# EAGLE schematic Final Project Circuit Diagram (EAGLE 7.2.0)
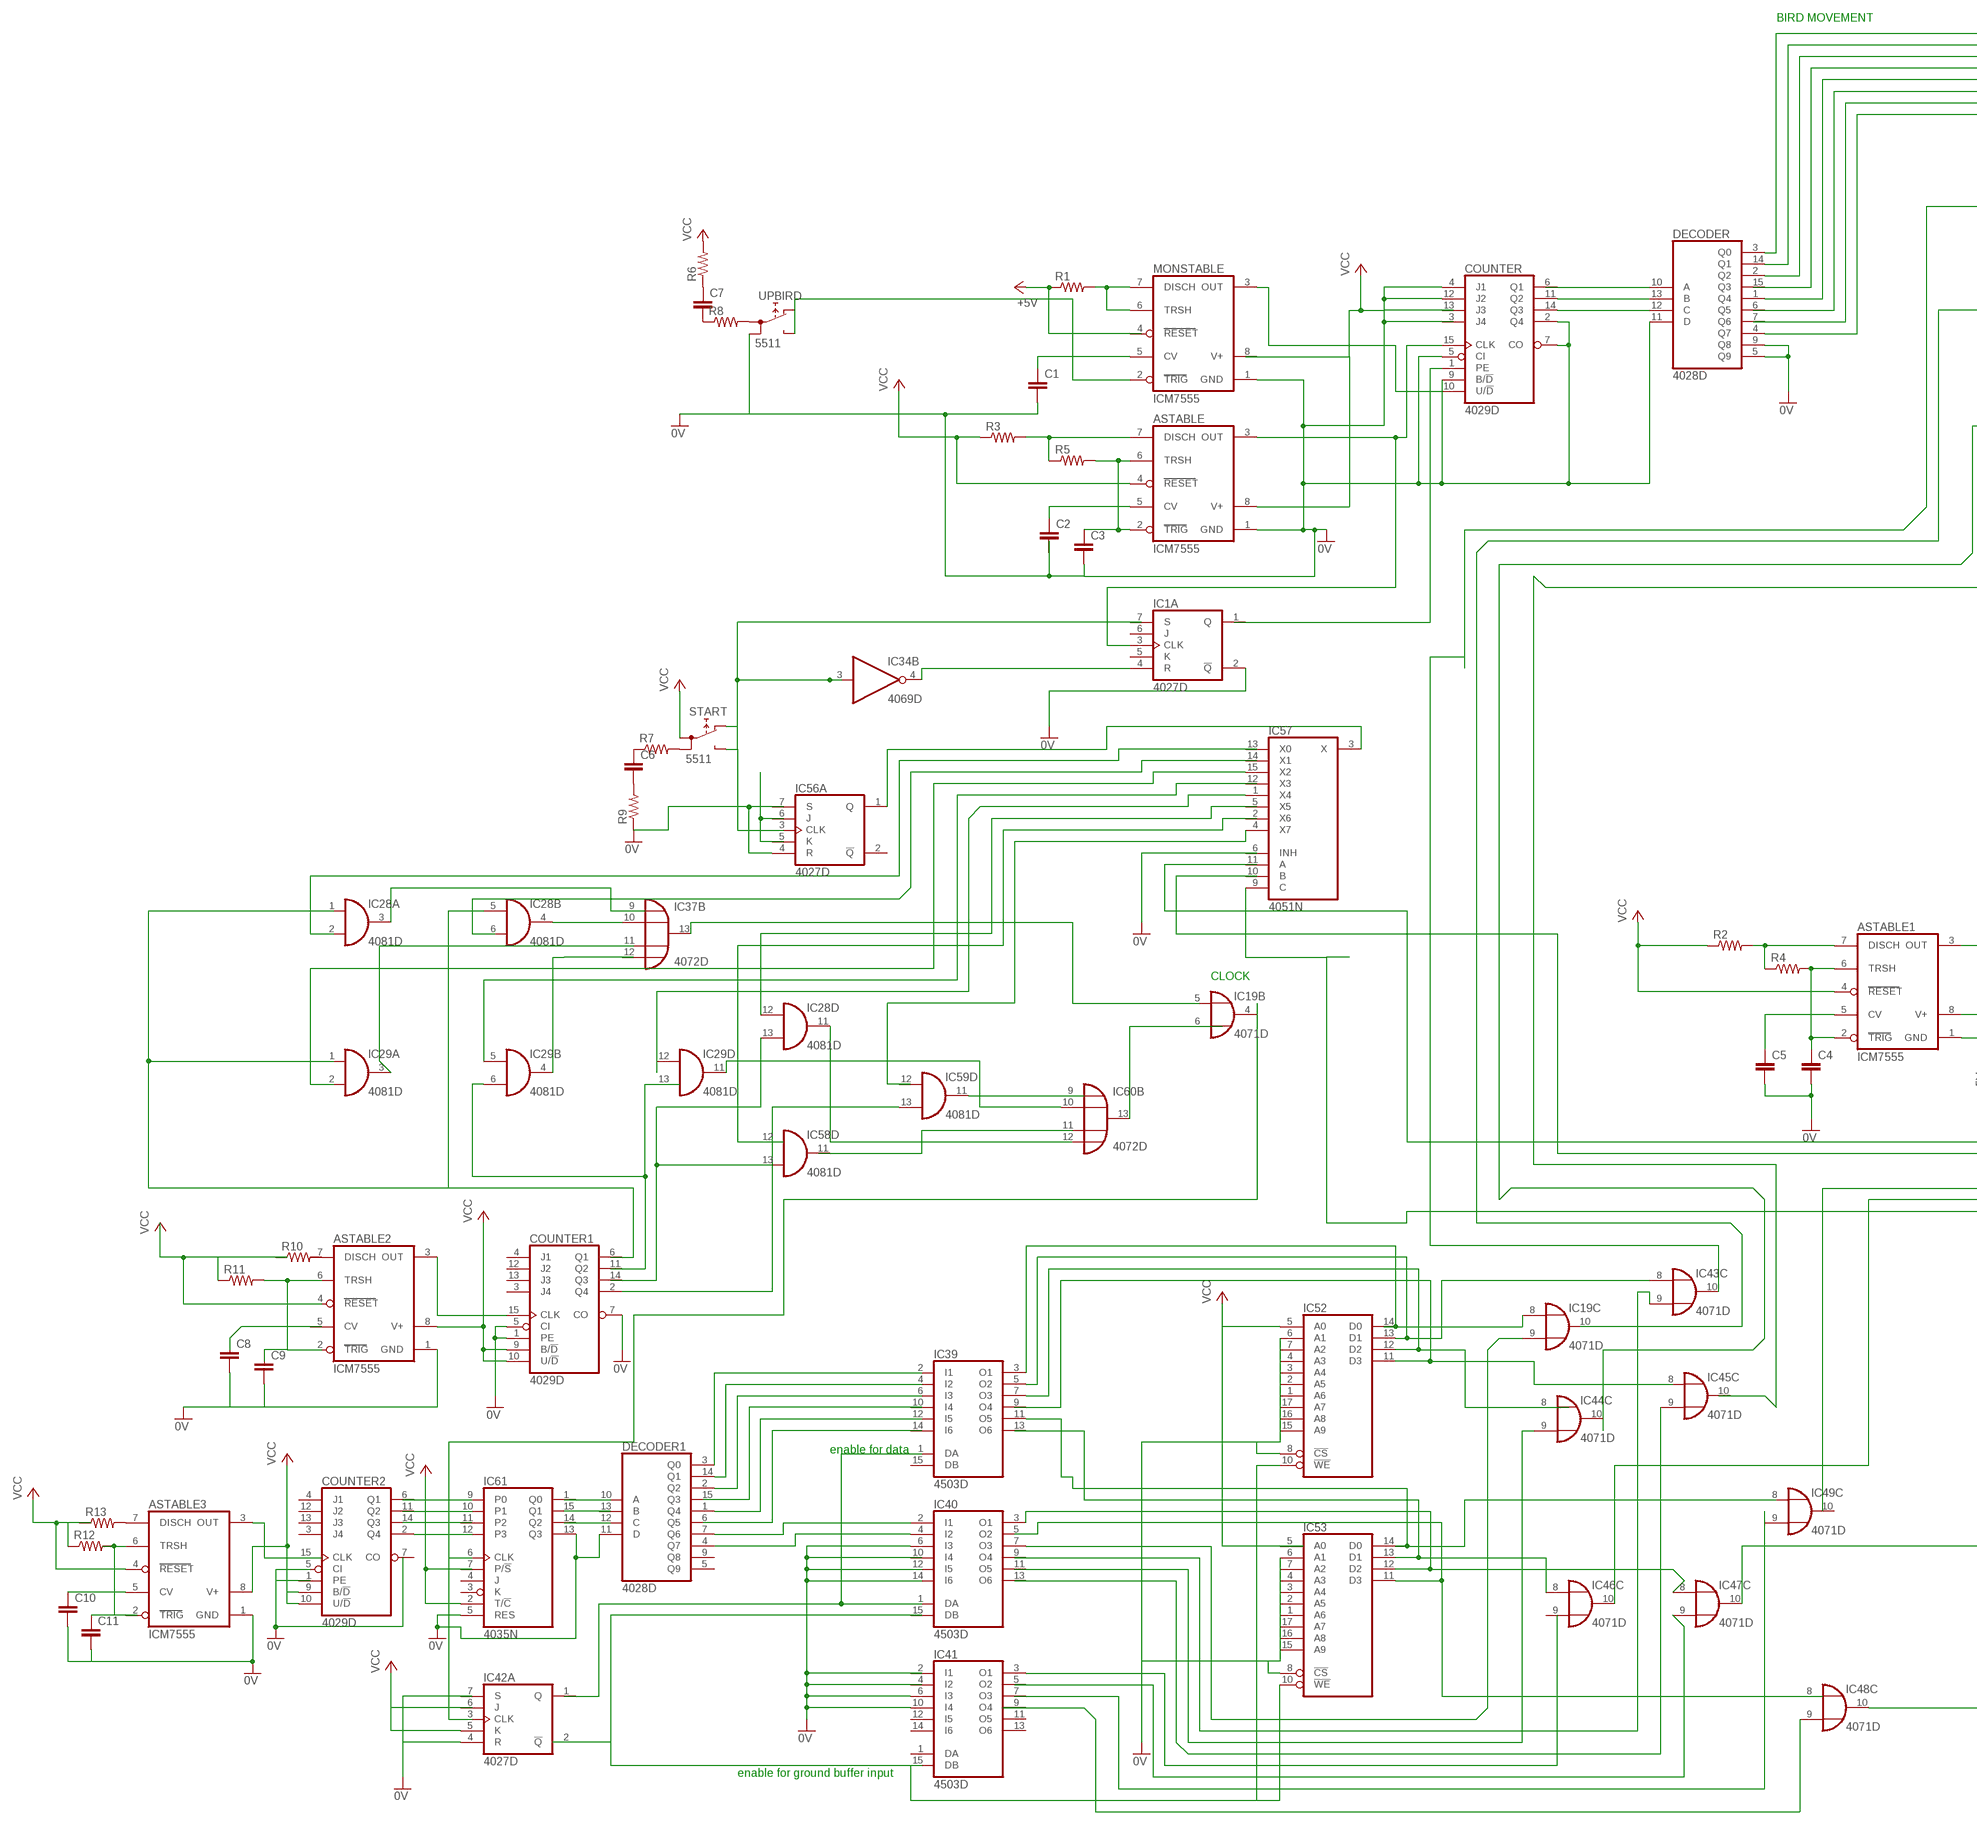
[diagram p0: schematic, sheet 1, part 1 of 2]
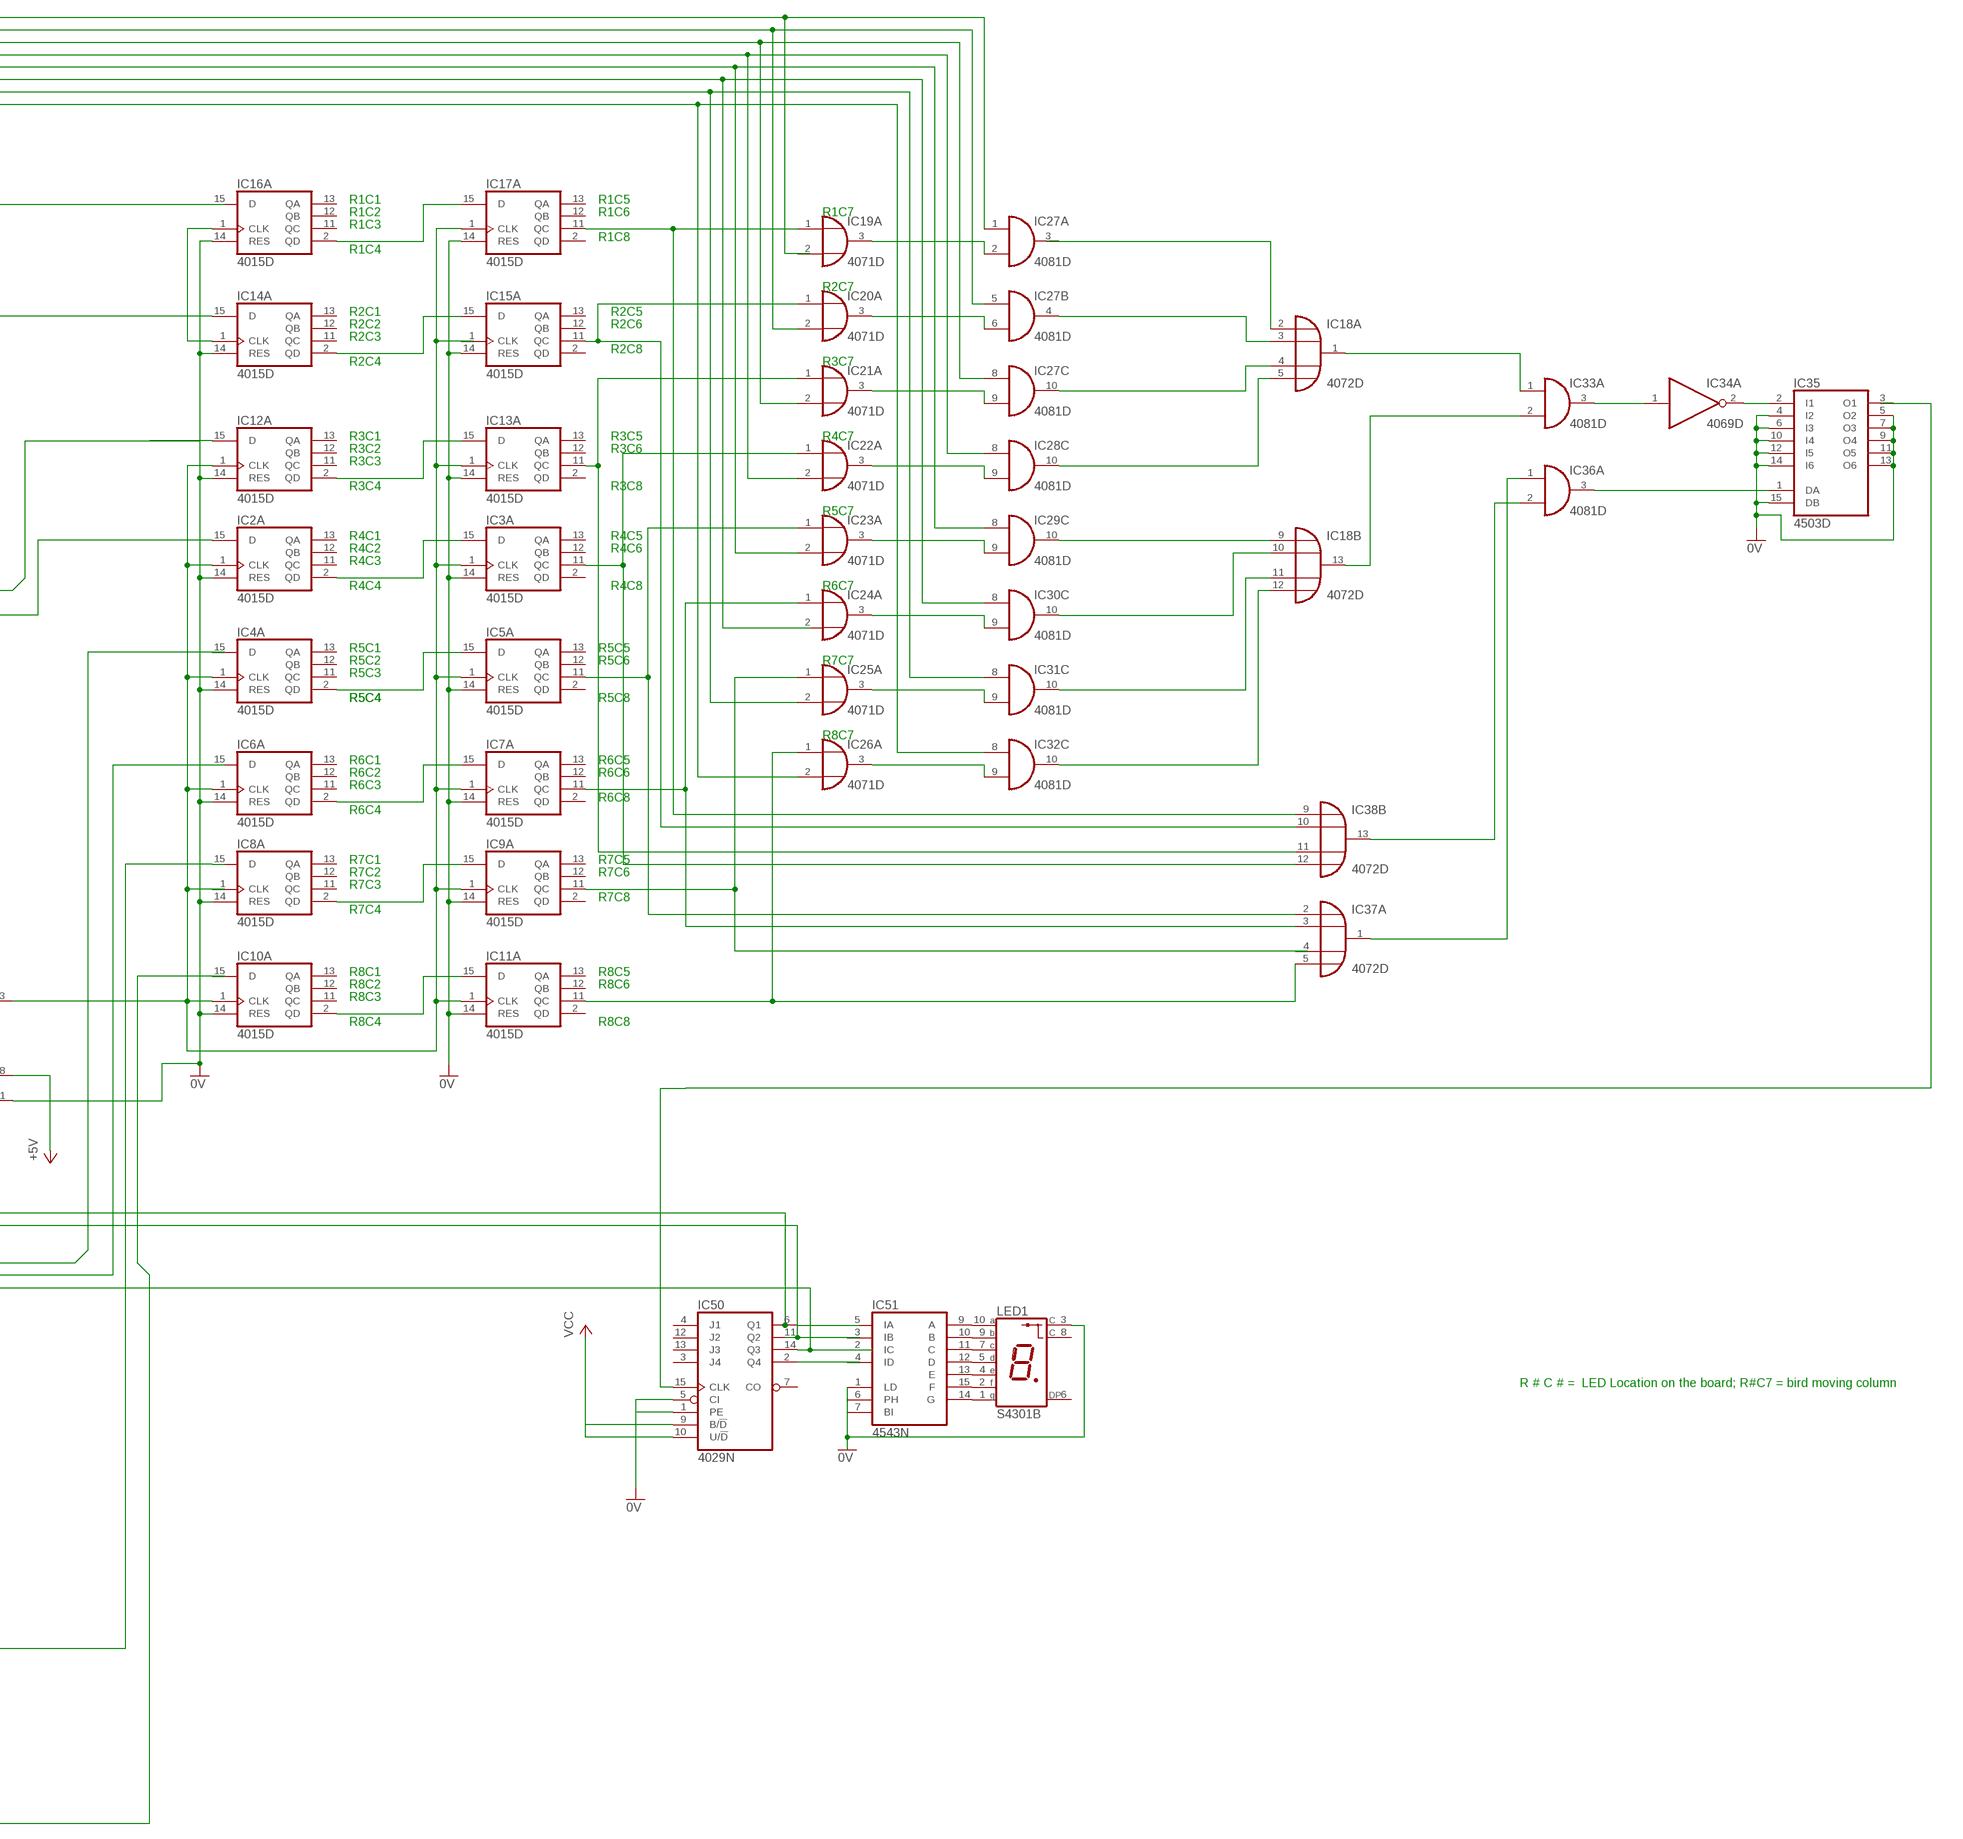
[diagram p1: schematic, sheet 1, part 2 of 2]

## Parts
ASTABLE  ICM7555  [DIL08]
ASTABLE1  ICM7555  [DIL08]
ASTABLE2  ICM7555  [DIL08]
ASTABLE3  ICM7555  [DIL08]
C1  C2.5/2  [C2.5-2]
C2  C2.5/2  [C2.5-2]
C3  C2.5/2  [C2.5-2]
C4  C2.5/2  [C2.5-2]
C5  C2.5/2  [C2.5-2]
C6  C2.5/2  [C2.5-2]
C7  C2.5/2  [C2.5-2]
C8  C2.5/2  [C2.5-2]
C9  C2.5/2  [C2.5-2]
C10  C2.5/2  [C2.5-2]
C11  C2.5/2  [C2.5-2]
COUNTER  4029D  [SO16]
COUNTER1  4029D  [SO16]
COUNTER2  4029D  [SO16]
DECODER  4028D  [SO16]
DECODER1  4028D  [SO16]
IC1  4027D  [SO16]
IC2  4015D  [SO16]
IC3  4015D  [SO16]
IC4  4015D  [SO16]
IC5  4015D  [SO16]
IC6  4015D  [SO16]
IC7  4015D  [SO16]
IC8  4015D  [SO16]
IC9  4015D  [SO16]
IC10  4015D  [SO16]
IC11  4015D  [SO16]
IC12  4015D  [SO16]
IC13  4015D  [SO16]
IC14  4015D  [SO16]
IC15  4015D  [SO16]
IC16  4015D  [SO16]
IC17  4015D  [SO16]
IC18  4072D  [SO14]
IC19  4071D  [SO14]
IC20  4071D  [SO14]
IC21  4071D  [SO14]
IC22  4071D  [SO14]
IC23  4071D  [SO14]
IC24  4071D  [SO14]
IC25  4071D  [SO14]
IC26  4071D  [SO14]
IC27  4081D  [SO14]
IC28  4081D  [SO14]
IC29  4081D  [SO14]
IC30  4081D  [SO14]
IC31  4081D  [SO14]
IC32  4081D  [SO14]
IC33  4081D  [SO14]
IC34  4069D  [SO14]
IC35  4503D  [SO16]
IC36  4081D  [SO14]
IC37  4072D  [SO14]
IC38  4072D  [SO14]
IC39  4503D  [SO16]
IC40  4503D  [SO16]
IC41  4503D  [SO16]
IC42  4027D  [SO16]
IC43  4071D  [SO14]
IC44  4071D  [SO14]
IC45  4071D  [SO14]
IC46  4071D  [SO14]
IC47  4071D  [SO14]
IC48  4071D  [SO14]
IC49  4071D  [SO14]
IC50  4029N  [DIL16]
IC51  4543N  [DIL16]
IC52  2114  [DIL18]
IC53  2114  [DIL18]
IC56  4027D  [SO16]
IC57  4051N  [DIL16]
IC58  4081D  [SO14]
IC59  4081D  [SO14]
IC60  4072D  [SO14]
IC61  4035N  [DIL16]
LED1  S4301B  [S4301B]
MONSTABLE  ICM7555  [DIL08]
R1  R-US_0204/7  [0204/7]
R2  R-US_0204/7  [0204/7]
R3  R-US_0204/7  [0204/7]
R4  R-US_0204/7  [0204/7]
R5  R-US_0204/7  [0204/7]
R6  R-US_0204/7  [0204/7]
R7  R-US_0204/7  [0204/7]
R8  R-US_0204/7  [0204/7]
R9  R-US_0204/7  [0204/7]
R10  R-US_0204/7  [0204/7]
R11  R-US_0204/7  [0204/7]
R12  R-US_0204/7  [0204/7]
R13  R-US_0204/7  [0204/7]
START  5511  [5511]
UPBIRD  5511  [5511]

## Nets
0V: ASTABLE1.1(GND) ASTABLE2.1(GND) ASTABLE3.1(GND) ASTABLE.1(GND) ASTABLE.8(V+) C1.2 C3.2 C4.2 C5.2 C8.2 C9.2 C10.2 COUNTER1.7(CO) COUNTER.2(Q4) COUNTER.4(J1) COUNTER.5(CI) COUNTER.7(CO) COUNTER.9(B/!D) COUNTER.12(J2) DECODER1.11(D) DECODER.5(Q9) DECODER.9(Q8) DECODER.11(D) IC1.2(A:!Q) IC2.14(A:RES) IC3.14(A:RES) IC4.14(A:RES) IC5.14(A:RES) IC6.14(A:RES) IC7.14(A:RES) IC8.14(A:RES) IC9.14(A:RES) IC10.14(A:RES) IC11.14(A:RES) IC12.14(A:RES) IC13.14(A:RES) IC14.14(A:RES) IC15.14(A:RES) IC16.14(A:RES) IC17.14(A:RES) IC35.4(I2) IC35.5(O2) IC35.6(I3) IC35.7(O3) IC35.9(O4) IC35.10(I4) IC35.11(O5) IC35.12(I5) IC35.13(O6) IC35.14(I6) IC35.15(DB) IC40.6(I3) IC41.6(I3) IC41.10(I4) IC50.1(PE) IC50.5(CI) IC51.1(LD) IC52.6(A1) IC52.8(!CS) IC56.4(A:R) IC61.5(RES) IC61.13(Q3) LED1.3(C) MONSTABLE.1(GND) R9.1 UPBIRD.1B ; supply symbol labelled VCC
+5V: ASTABLE1.8(V+) R1.1
N$1: MONSTABLE.2(TRIG) UPBIRD.NC UPBIRD.NO
N$2: COUNTER.10(U/!D) MONSTABLE.3(OUT)
N$3: DECODER.10(A)
N$4: COUNTER.11(Q2) DECODER.13(B)
N$5: COUNTER.14(Q3) DECODER.12(C)
N$6: ASTABLE.5(CV) C2.1
N$7: ASTABLE1.3(OUT) IC2.1(A:CLK) IC3.1(A:CLK) IC4.1(A:CLK) IC5.1(A:CLK) IC6.1(A:CLK) IC7.1(A:CLK) IC9.1(A:CLK) IC10.1(A:CLK) IC11.1(A:CLK) IC12.1(A:CLK) IC13.1(A:CLK) IC17.1(A:CLK)
N$8: IC16.2(A:QD) IC17.15(A:D)
N$9: COUNTER.1(PE)
N$10: C1.1 MONSTABLE.5(CV)
N$11: MONSTABLE.6(TRSH) MONSTABLE.7(DISCH) R1.2
N$12: IC14.2(A:QD) IC15.15(A:D)
N$13: ASTABLE.7(DISCH) R3.2 R5.1
N$14: ASTABLE.3(OUT) COUNTER.15(CLK)
N$15: ASTABLE.2(TRIG) ASTABLE.6(TRSH) C3.1 R5.2
N$16: IC12.2(A:QD) IC13.15(A:D)
N$17: IC2.2(A:QD) IC3.15(A:D)
N$18: IC4.2(A:QD) IC5.15(A:D)
N$19: IC6.2(A:QD) IC7.15(A:D)
N$20: IC8.2(A:QD) IC9.15(A:D)
N$21: IC10.2(A:QD) IC11.15(A:D)
N$22: IC3.11(A:QC) IC22.1(A:I0) IC38.12(B:I3)
N$23: IC17.11(A:QC) IC19.1(A:I0) IC38.9(B:I0)
N$24: ASTABLE1.7(DISCH) R2.2 R4.1
N$25: IC15.11(A:QC) IC20.1(A:I0) IC38.10(B:I1)
N$26: IC13.11(A:QC) IC21.1(A:I0) IC38.11(B:I2)
N$27: ASTABLE1.5(CV) C5.1
N$28: ASTABLE1.2(TRIG) ASTABLE1.6(TRSH) C4.1 R4.2
N$29: IC5.11(A:QC) IC23.1(A:I0) IC37.2(A:I0)
N$30: IC7.11(A:QC) IC24.1(A:I0) IC37.3(A:I1)
N$31: IC9.11(A:QC) IC25.1(A:I0)
N$32: IC11.11(A:QC) IC26.1(A:I0) IC37.5(A:I3)
N$33: DECODER.3(Q0) IC27.1(A:I0)
N$34: DECODER.14(Q1) IC20.2(A:I1) IC27.5(B:I0)
N$35: DECODER.2(Q2) IC21.2(A:I1) IC27.8(C:I0)
N$36: IC22.2(A:I1) IC28.8(C:I0)
N$37: DECODER.1(Q4) IC23.2(A:I1) IC29.8(C:I0)
N$38: IC30.8(C:I0)
N$39: IC25.2(A:I1) IC31.8(C:I0)
N$40: DECODER.4(Q7) IC26.2(A:I1) IC32.8(C:I0)
N$41: IC19.3(A:O) IC27.2(A:I1)
N$42: IC20.3(A:O) IC27.6(B:I1)
N$43: IC21.3(A:O) IC27.9(C:I1)
N$44: IC22.3(A:O) IC28.9(C:I1)
N$45: IC23.3(A:O) IC29.9(C:I1)
N$46: IC24.3(A:O) IC30.9(C:I1)
N$47: IC25.3(A:O) IC31.9(C:I1)
N$48: IC26.3(A:O) IC32.9(C:I1)
N$49: IC18.2(A:I0)
N$50: IC18.3(A:I1) IC27.4(B:O)
N$51: IC18.4(A:I2) IC27.10(C:O)
N$52: IC18.5(A:I3) IC28.10(C:O)
N$53: IC18.9(B:I0) IC29.10(C:O)
N$54: IC18.12(B:I3) IC32.10(C:O)
N$55: IC18.11(B:I2) IC31.10(C:O)
N$56: IC18.10(B:I1) IC30.10(C:O)
N$57: IC18.1(A:O) IC33.1(A:I0)
N$58: IC18.13(B:O) IC33.2(A:I1)
N$59: IC33.3(A:O) IC34.1(A:I)
N$60: IC34.2(A:O) IC35.2(I1)
N$61: IC35.1(DA) IC36.3(A:O)
N$62: IC36.1(A:I0) IC37.1(A:O)
N$63: IC36.2(A:I1) IC38.13(B:O)
N$64: IC39.11(O5) IC53.14(D0)
N$65: DECODER1.3(Q0)
N$66: DECODER1.14(Q1)
N$67: DECODER1.2(Q2)
N$69: DECODER1.1(Q4)
N$71: DECODER1.7(Q6) IC40.2(I1)
N$72: DECODER1.4(Q7) IC40.4(I2)
N$73: IC42.5(A:K) ; supply symbol labelled VCC
N$74: IC19.8(C:I0) IC39.3(O1) IC52.14(D0)
N$75: IC42.4(A:R) ; supply symbol labelled 0V
N$77: IC52.10(!WE) IC53.10(!WE)
N$78: IC39.5(O2) IC43.8(C:I0) IC52.13(D1)
N$79: IC39.7(O3) IC52.12(D2)
N$80: IC14.1(A:CLK) IC16.1(A:CLK)
N$81: IC14.15(A:D)
N$82: IC12.15(A:D)
N$83: IC2.15(A:D)
N$86: IC48.10(C:O)
N$87: IC50.6(Q1)
N$88: IC50.11(Q2)
N$89: IC8.15(A:D) IC47.10(C:O)
N$90: IC50.14(Q3) IC57.9(C)
N$91: IC50.2(Q4)
N$92: C7.2 R8.1
N$93: C7.1 R6.1
N$94: R8.2 UPBIRD.1A
N$96: R7.2 START.1B
N$97: C6.1 R7.1
N$98: C6.2 R9.2
N$99: IC34.3(B:I) START.NC START.NO
N$100: IC1.3(A:CLK)
N$101: IC1.4(A:R) IC34.4(B:O)
N$102: R11.1
N$103: C9.1 R11.2
N$104: COUNTER1.1(PE) COUNTER1.5(CI) ; supply symbol labelled 0V
N$105: C8.1
N$107: IC28.5(B:I0)
N$108: ASTABLE2.3(OUT) COUNTER1.15(CLK)
N$111: IC57.15(X2)
N$112: IC56.1(A:Q) IC57.3(X)
N$114: IC29.6(B:I1)
N$115: IC29.5(B:I0)
N$116: IC57.1(X4)
N$117: IC28.13(D:I1)
N$118: IC57.4(X7) IC59.12(D:I0)
N$119: IC28.12(D:I0)
N$121: IC59.11(D:O)
N$122: COUNTER1.2(Q4) IC59.13(D:I1)
N$123: IC28.11(D:O)
N$125: IC29.11(D:O) IC60.10(B:I1)
N$126: IC28.3(A:O)
N$127: IC28.4(B:O) IC37.10(B:I1)
N$128: IC29.3(A:O)
N$129: ASTABLE3.7(DISCH) R13.2
N$130: IC29.4(B:O)
N$131: IC37.13(B:O)
N$132: IC60.13(B:O)
N$133: ASTABLE3.3(OUT)
N$134: ASTABLE3.6(TRSH) R12.2
N$135: C11.1
N$136: ASTABLE3.5(CV) C10.1
N$138: C11.2
N$141: COUNTER2.2(Q4)
N$146: IC53.6(A1) IC53.8(!CS)
N$147: IC46.8(C:I0) IC53.13(D1)
N$148: IC40.3(O1) IC47.8(C:I0) IC53.12(D2)
N$149: IC53.11(D3)
N$150: IC43.10(C:O)
N$151: IC52.11(D3)
N$152: IC19.9(C:I1) IC40.7(O3)
N$153: IC43.9(C:I1)
N$154: IC44.9(C:I1)
N$155: IC45.9(C:I1)
N$156: IC41.3(O1)
N$157: IC47.9(C:I1)
N$159: IC48.9(C:I1)
N$165: IC46.10(C:O)
N$166: IC50.15(CLK)
N$167: IC51.15(F) LED1.2(F)
N$168: IC51.12(D) LED1.5(D)
N$169: IC51.10(B) LED1.9(B)
N$170: IC51.9(A) LED1.10(A)
N$171: IC51.11(C) LED1.7(C)
N$172: IC51.13(E) LED1.4(E)
N$173: IC51.14(G) LED1.1(G)
VCC: ASTABLE1.4(RESET) ASTABLE2.8(V+) ASTABLE3.4(RESET) ASTABLE3.8(V+) ASTABLE.4(RESET) COUNTER1.9(B/!D) COUNTER1.10(U/!D) COUNTER2.9(B/!D) COUNTER2.10(U/!D) IC50.9(B/!D) IC50.10(U/!D) IC52.5(A0) IC61.2(T/!C) R2.1 R3.1 R6.2 R12.1 START.1A
Unconnected: ASTABLE2.2(TRIG) ASTABLE2.4(RESET) ASTABLE2.5(CV) ASTABLE2.6(TRSH) ASTABLE2.7(DISCH) ASTABLE3.2(TRIG) C2.2 COUNTER1.3(J4) COUNTER1.4(J1) COUNTER1.6(Q1) COUNTER1.11(Q2) COUNTER1.12(J2) COUNTER1.13(J3) COUNTER1.14(Q3) COUNTER2.1(PE) COUNTER2.3(J4) COUNTER2.4(J1) COUNTER2.5(CI) COUNTER2.6(Q1) COUNTER2.7(CO) COUNTER2.11(Q2) COUNTER2.12(J2) COUNTER2.13(J3) COUNTER2.14(Q3) COUNTER2.15(CLK) COUNTER.3(J4) COUNTER.6(Q1) COUNTER.13(J3) DECODER1.5(Q9) DECODER1.6(Q5) DECODER1.9(Q8) DECODER1.10(A) DECODER1.12(C) DECODER1.13(B) DECODER1.15(Q3) DECODER.6(Q5) DECODER.7(Q6) DECODER.15(Q3) IC1.1(A:Q) IC1.5(A:K) IC1.6(A:J) IC1.7(A:S) IC1.9(B:S) IC1.10(B:J) IC1.11(B:K) IC1.12(B:R) IC1.13(B:CLK) IC1.14(B:!Q) IC1.15(B:Q) IC2.3(B:QC) IC2.4(B:QB) IC2.5(B:QA) IC2.6(B:RES) IC2.7(B:D) IC2.9(B:CLK) IC2.10(B:QD) IC2.11(A:QC) IC2.12(A:QB) IC2.13(A:QA) IC3.2(A:QD) IC3.3(B:QC) IC3.4(B:QB) IC3.5(B:QA) IC3.6(B:RES) IC3.7(B:D) IC3.9(B:CLK) IC3.10(B:QD) IC3.12(A:QB) IC3.13(A:QA) IC4.3(B:QC) IC4.4(B:QB) IC4.5(B:QA) IC4.6(B:RES) IC4.7(B:D) IC4.9(B:CLK) IC4.10(B:QD) IC4.11(A:QC) IC4.12(A:QB) IC4.13(A:QA) IC4.15(A:D) IC5.2(A:QD) IC5.3(B:QC) IC5.4(B:QB) IC5.5(B:QA) IC5.6(B:RES) IC5.7(B:D) IC5.9(B:CLK) IC5.10(B:QD) IC5.12(A:QB) IC5.13(A:QA) IC6.3(B:QC) IC6.4(B:QB) IC6.5(B:QA) IC6.6(B:RES) IC6.7(B:D) IC6.9(B:CLK) IC6.10(B:QD) IC6.11(A:QC) IC6.12(A:QB) IC6.13(A:QA) IC6.15(A:D) IC7.2(A:QD) IC7.3(B:QC) IC7.4(B:QB) IC7.5(B:QA) IC7.6(B:RES) IC7.7(B:D) IC7.9(B:CLK) IC7.10(B:QD) IC7.12(A:QB) IC7.13(A:QA) IC8.1(A:CLK) IC8.3(B:QC) IC8.4(B:QB) IC8.5(B:QA) IC8.6(B:RES) IC8.7(B:D) IC8.9(B:CLK) IC8.10(B:QD) IC8.11(A:QC) IC8.12(A:QB) IC8.13(A:QA) IC9.2(A:QD) IC9.3(B:QC) IC9.4(B:QB) IC9.5(B:QA) IC9.6(B:RES) IC9.7(B:D) IC9.9(B:CLK) IC9.10(B:QD) IC9.12(A:QB) IC9.13(A:QA) IC10.3(B:QC) IC10.4(B:QB) IC10.5(B:QA) IC10.6(B:RES) IC10.7(B:D) IC10.9(B:CLK) IC10.10(B:QD) IC10.11(A:QC) IC10.12(A:QB) IC10.13(A:QA) IC10.15(A:D) IC11.2(A:QD) IC11.3(B:QC) IC11.4(B:QB) IC11.5(B:QA) IC11.6(B:RES) IC11.7(B:D) IC11.9(B:CLK) IC11.10(B:QD) IC11.12(A:QB) IC11.13(A:QA) IC12.3(B:QC) IC12.4(B:QB) IC12.5(B:QA) IC12.6(B:RES) IC12.7(B:D) IC12.9(B:CLK) IC12.10(B:QD) IC12.11(A:QC) IC12.12(A:QB) IC12.13(A:QA) IC13.2(A:QD) IC13.3(B:QC) IC13.4(B:QB) IC13.5(B:QA) IC13.6(B:RES) IC13.7(B:D) IC13.9(B:CLK) IC13.10(B:QD) IC13.12(A:QB) IC13.13(A:QA) IC14.3(B:QC) IC14.4(B:QB) IC14.5(B:QA) IC14.6(B:RES) IC14.7(B:D) IC14.9(B:CLK) IC14.10(B:QD) IC14.11(A:QC) IC14.12(A:QB) IC14.13(A:QA) IC15.1(A:CLK) IC15.2(A:QD) IC15.3(B:QC) IC15.4(B:QB) IC15.5(B:QA) IC15.6(B:RES) IC15.7(B:D) IC15.9(B:CLK) IC15.10(B:QD) IC15.12(A:QB) IC15.13(A:QA) IC16.3(B:QC) IC16.4(B:QB) IC16.5(B:QA) IC16.6(B:RES) IC16.7(B:D) IC16.9(B:CLK) IC16.10(B:QD) IC16.11(A:QC) IC16.12(A:QB) IC16.13(A:QA) IC16.15(A:D) IC17.2(A:QD) IC17.3(B:QC) IC17.4(B:QB) IC17.5(B:QA) IC17.6(B:RES) IC17.7(B:D) IC17.9(B:CLK) IC17.10(B:QD) IC17.12(A:QB) IC17.13(A:QA) IC19.2(A:I1) IC19.4(B:O) IC19.5(B:I0) IC19.6(B:I1) IC19.10(C:O) IC19.11(D:O) IC19.12(D:I0) IC19.13(D:I1) IC20.4(B:O) IC20.5(B:I0) IC20.6(B:I1) IC20.8(C:I0) IC20.9(C:I1) IC20.10(C:O) IC20.11(D:O) IC20.12(D:I0) IC20.13(D:I1) IC21.4(B:O) IC21.5(B:I0) IC21.6(B:I1) IC21.8(C:I0) IC21.9(C:I1) IC21.10(C:O) IC21.11(D:O) IC21.12(D:I0) IC21.13(D:I1) IC22.4(B:O) IC22.5(B:I0) IC22.6(B:I1) IC22.8(C:I0) IC22.9(C:I1) IC22.10(C:O) IC22.11(D:O) IC22.12(D:I0) IC22.13(D:I1) IC23.4(B:O) IC23.5(B:I0) IC23.6(B:I1) IC23.8(C:I0) IC23.9(C:I1) IC23.10(C:O) IC23.11(D:O) IC23.12(D:I0) IC23.13(D:I1) IC24.2(A:I1) IC24.4(B:O) IC24.5(B:I0) IC24.6(B:I1) IC24.8(C:I0) IC24.9(C:I1) IC24.10(C:O) IC24.11(D:O) IC24.12(D:I0) IC24.13(D:I1) IC25.4(B:O) IC25.5(B:I0) IC25.6(B:I1) IC25.8(C:I0) IC25.9(C:I1) IC25.10(C:O) IC25.11(D:O) IC25.12(D:I0) IC25.13(D:I1) IC26.4(B:O) IC26.5(B:I0) IC26.6(B:I1) IC26.8(C:I0) IC26.9(C:I1) IC26.10(C:O) IC26.11(D:O) IC26.12(D:I0) IC26.13(D:I1) IC27.3(A:O) IC27.11(D:O) IC27.12(D:I0) IC27.13(D:I1) IC28.1(A:I0) IC28.2(A:I1) IC28.6(B:I1) IC29.1(A:I0) IC29.2(A:I1) IC29.12(D:I0) IC29.13(D:I1) IC30.1(A:I0) IC30.2(A:I1) IC30.3(A:O) IC30.4(B:O) IC30.5(B:I0) IC30.6(B:I1) IC30.11(D:O) IC30.12(D:I0) IC30.13(D:I1) IC31.1(A:I0) IC31.2(A:I1) IC31.3(A:O) IC31.4(B:O) IC31.5(B:I0) IC31.6(B:I1) IC31.11(D:O) IC31.12(D:I0) IC31.13(D:I1) IC32.1(A:I0) IC32.2(A:I1) IC32.3(A:O) IC32.4(B:O) IC32.5(B:I0) IC32.6(B:I1) IC32.11(D:O) IC32.12(D:I0) IC32.13(D:I1) IC33.4(B:O) IC33.5(B:I0) IC33.6(B:I1) IC33.8(C:I0) IC33.9(C:I1) IC33.10(C:O) IC33.11(D:O) IC33.12(D:I0) IC33.13(D:I1) IC34.5(C:I) IC34.6(C:O) IC34.8(D:O) IC34.9(D:I) IC34.10(E:O) IC34.11(E:I) IC34.12(F:O) IC34.13(F:I) IC35.3(O1) IC36.4(B:O) IC36.5(B:I0) IC36.6(B:I1) IC36.8(C:I0) IC36.9(C:I1) IC36.10(C:O) IC36.11(D:O) IC36.12(D:I0) IC36.13(D:I1) IC37.4(A:I2) IC37.9(B:I0) IC37.11(B:I2) IC37.12(B:I3) IC38.1(A:O) IC38.2(A:I0) IC38.3(A:I1) IC38.4(A:I2) IC38.5(A:I3) IC39.1(DA) IC39.2(I1) IC39.4(I2) IC39.6(I3) IC39.9(O4) IC39.10(I4) IC39.12(I5) IC39.13(O6) IC39.14(I6) IC39.15(DB) IC40.1(DA) IC40.5(O2) IC40.9(O4) IC40.10(I4) IC40.11(O5) IC40.12(I5) IC40.13(O6) IC40.14(I6) IC40.15(DB) IC41.1(DA) IC41.2(I1) IC41.4(I2) IC41.5(O2) IC41.7(O3) IC41.9(O4) IC41.11(O5) IC41.12(I5) IC41.13(O6) IC41.14(I6) IC41.15(DB) IC42.1(A:Q) IC42.2(A:!Q) IC42.3(A:CLK) IC42.6(A:J) IC42.7(A:S) IC42.9(B:S) IC42.10(B:J) IC42.11(B:K) IC42.12(B:R) IC42.13(B:CLK) IC42.14(B:!Q) IC42.15(B:Q) IC43.1(A:I0) IC43.2(A:I1) IC43.3(A:O) IC43.4(B:O) IC43.5(B:I0) IC43.6(B:I1) IC43.11(D:O) IC43.12(D:I0) IC43.13(D:I1) IC44.1(A:I0) IC44.2(A:I1) IC44.3(A:O) IC44.4(B:O) IC44.5(B:I0) IC44.6(B:I1) IC44.8(C:I0) IC44.10(C:O) IC44.11(D:O) IC44.12(D:I0) IC44.13(D:I1) IC45.1(A:I0) IC45.2(A:I1) IC45.3(A:O) IC45.4(B:O) IC45.5(B:I0) IC45.6(B:I1) IC45.8(C:I0) IC45.10(C:O) IC45.11(D:O) IC45.12(D:I0) IC45.13(D:I1) IC46.1(A:I0) IC46.2(A:I1) IC46.3(A:O) IC46.4(B:O) IC46.5(B:I0) IC46.6(B:I1) IC46.9(C:I1) IC46.11(D:O) IC46.12(D:I0) IC46.13(D:I1) IC47.1(A:I0) IC47.2(A:I1) IC47.3(A:O) IC47.4(B:O) IC47.5(B:I0) IC47.6(B:I1) IC47.11(D:O) IC47.12(D:I0) IC47.13(D:I1) IC48.1(A:I0) IC48.2(A:I1) IC48.3(A:O) IC48.4(B:O) IC48.5(B:I0) IC48.6(B:I1) IC48.8(C:I0) IC48.11(D:O) IC48.12(D:I0) IC48.13(D:I1) IC49.1(A:I0) IC49.2(A:I1) IC49.3(A:O) IC49.4(B:O) IC49.5(B:I0) IC49.6(B:I1) IC49.8(C:I0) IC49.9(C:I1) IC49.10(C:O) IC49.11(D:O) IC49.12(D:I0) IC49.13(D:I1) IC50.3(J4) IC50.4(J1) IC50.7(CO) IC50.12(J2) IC50.13(J3) IC51.2(IC) IC51.3(IB) IC51.4(ID) IC51.5(IA) IC51.6(PH) IC51.7(BI) IC52.1(A6) IC52.2(A5) IC52.3(A4) IC52.4(A3) IC52.7(A2) IC52.15(A9) IC52.16(A8) IC52.17(A7) IC53.1(A6) IC53.2(A5) IC53.3(A4) IC53.4(A3) IC53.5(A0) IC53.7(A2) IC53.15(A9) IC53.16(A8) IC53.17(A7) IC56.2(A:!Q) IC56.3(A:CLK) IC56.5(A:K) IC56.6(A:J) IC56.7(A:S) IC56.9(B:S) IC56.10(B:J) IC56.11(B:K) IC56.12(B:R) IC56.13(B:CLK) IC56.14(B:!Q) IC56.15(B:Q) IC57.2(X6) IC57.5(X5) IC57.6(INH) IC57.10(B) IC57.11(A) IC57.12(X3) IC57.13(X0) IC57.14(X1) IC58.1(A:I0) IC58.2(A:I1) IC58.3(A:O) IC58.4(B:O) IC58.5(B:I0) IC58.6(B:I1) IC58.8(C:I0) IC58.9(C:I1) IC58.10(C:O) IC58.11(D:O) IC58.12(D:I0) IC58.13(D:I1) IC59.1(A:I0) IC59.2(A:I1) IC59.3(A:O) IC59.4(B:O) IC59.5(B:I0) IC59.6(B:I1) IC59.8(C:I0) IC59.9(C:I1) IC59.10(C:O) IC60.1(A:O) IC60.2(A:I0) IC60.3(A:I1) IC60.4(A:I2) IC60.5(A:I3) IC60.9(B:I0) IC60.11(B:I2) IC60.12(B:I3) IC61.1(Q0) IC61.3(K) IC61.4(J) IC61.6(CLK) IC61.7(P/!S) IC61.9(P0) IC61.10(P1) IC61.11(P2) IC61.12(P3) IC61.14(Q2) IC61.15(Q1) LED1.6(DP) LED1.8(C) MONSTABLE.4(RESET) R10.1 R10.2 R13.1

## Notes on the sheet
- BIRD MOVEMENT
- R1C1 | R1C5
- R1C2 | R1C6 | R1C7
- R1C3
- R1C8
- R1C4
- R2C7
- R2C1 | R2C5
- R2C2 | R2C6
- R2C3
- R2C8
- R2C4 | R3C7
- R3C1 | R3C5 | R4C7
- R3C2 | R3C6
- R3C3
- R3C4 | R3C8
- R5C7
- R4C1 | R4C5
- R4C2 | R4C6
- R4C3
- R4C4 | R4C8 | R6C7
- R5C1 | R5C5
- R5C2 | R5C6 | R7C7
- R5C3
- R5C4 | R5C4 | R5C8
- R8C7
- R6C1 | R6C5
- R6C2 | R6C6
- R6C3
- R6C8
- R6C4
- R7C1 | R7C5
- R7C2 | R7C6
- R7C3
- R7C8
- R7C4
- R8C1 | R8C5
- R8C2 | R8C6
- R8C3
- R8C4 | R8C8
- CLOCK
- R # C # =  LED Location on the board; R#C7 = bird moving column
- enable for data
- enable for ground buffer input

## Power pins joined to a net without a drawn wire
GND: IC52.9(GND) IC53.9(GND) IC57.8(GND)
V+: MONSTABLE.8(V+)
VCC: IC52.18(VCC) IC53.18(VCC) IC57.16(VCC)
VDD: COUNTER1.16(VDD) COUNTER2.16(VDD) COUNTER.16(VDD) DECODER1.16(VDD) DECODER.16(VDD) IC1.16(P:VDD) IC2.16(P:VDD) IC3.16(P:VDD) IC4.16(P:VDD) IC5.16(P:VDD) IC6.16(P:VDD) IC7.16(P:VDD) IC8.16(P:VDD) IC9.16(P:VDD) IC10.16(P:VDD) IC11.16(P:VDD) IC12.16(P:VDD) IC13.16(P:VDD) IC14.16(P:VDD) IC15.16(P:VDD) IC16.16(P:VDD) IC17.16(P:VDD) IC18.14(P:VDD) IC19.14(P:VDD) IC20.14(P:VDD) IC21.14(P:VDD) IC22.14(P:VDD) IC23.14(P:VDD) IC24.14(P:VDD) IC25.14(P:VDD) IC26.14(P:VDD) IC27.14(P:VDD) IC28.14(P:VDD) IC29.14(P:VDD) IC30.14(P:VDD) IC31.14(P:VDD) IC32.14(P:VDD) IC33.14(P:VDD) IC34.14(P:VDD) IC35.16(VDD) IC36.14(P:VDD) IC37.14(P:VDD) IC38.14(P:VDD) IC39.16(VDD) IC40.16(VDD) IC41.16(VDD) IC42.16(P:VDD) IC43.14(P:VDD) IC44.14(P:VDD) IC45.14(P:VDD) IC46.14(P:VDD) IC47.14(P:VDD) IC48.14(P:VDD) IC49.14(P:VDD) IC50.16(VDD) IC51.16(VDD) IC56.16(P:VDD) IC58.14(P:VDD) IC59.14(P:VDD) IC60.14(P:VDD) IC61.16(VDD)
VEE: IC57.7(VEE)
VSS: COUNTER1.8(VSS) COUNTER2.8(VSS) COUNTER.8(VSS) DECODER1.8(VSS) DECODER.8(VSS) IC1.8(P:VSS) IC2.8(P:VSS) IC3.8(P:VSS) IC4.8(P:VSS) IC5.8(P:VSS) IC6.8(P:VSS) IC7.8(P:VSS) IC8.8(P:VSS) IC9.8(P:VSS) IC10.8(P:VSS) IC11.8(P:VSS) IC12.8(P:VSS) IC13.8(P:VSS) IC14.8(P:VSS) IC15.8(P:VSS) IC16.8(P:VSS) IC17.8(P:VSS) IC18.7(P:VSS) IC19.7(P:VSS) IC20.7(P:VSS) IC21.7(P:VSS) IC22.7(P:VSS) IC23.7(P:VSS) IC24.7(P:VSS) IC25.7(P:VSS) IC26.7(P:VSS) IC27.7(P:VSS) IC28.7(P:VSS) IC29.7(P:VSS) IC30.7(P:VSS) IC31.7(P:VSS) IC32.7(P:VSS) IC33.7(P:VSS) IC34.7(P:VSS) IC35.8(VSS) IC36.7(P:VSS) IC37.7(P:VSS) IC38.7(P:VSS) IC39.8(VSS) IC40.8(VSS) IC41.8(VSS) IC42.8(P:VSS) IC43.7(P:VSS) IC44.7(P:VSS) IC45.7(P:VSS) IC46.7(P:VSS) IC47.7(P:VSS) IC48.7(P:VSS) IC49.7(P:VSS) IC50.8(VSS) IC51.8(VSS) IC56.8(P:VSS) IC58.7(P:VSS) IC59.7(P:VSS) IC60.7(P:VSS) IC61.8(VSS)

## Library data of the parts
ASTABLE ASTABLE1-ASTABLE3 MONSTABLE = maxim:ICM7555: TIMER; MF: MAXIM; MPN: ICM7555IPA+; OC_FARNELL: 9663762; OC_NEWARK: 68K4387
C1-C11 = capacitor-wima:C: CAPACITOR naming: grid - package width
COUNTER COUNTER1 COUNTER2 IC50 = 40xx:4029: Binary/decimal up/down COUNTER
DECODER DECODER1 = 40xx:4028: BCD to decimal DECODER
IC1 IC42 IC56 = 40xx:4027: Dual JK FLIP FLOP
IC2-IC17 = 40xx:4015: Dual 4-bit static SHIFT REGISTER
IC18 IC37 IC38 IC60 = 40xx:4072: Dual 4-input OR
IC19-IC26 IC43-IC49 = 40xx:4071: Quad 2-input OR
IC27-IC33 IC36 IC58 IC59 = 40xx:4081: Quad 2-input AND
IC34 = 40xx:4069: Hex INVERTER
IC35 IC39-IC41 = 45xx:4503: Tri-state hex BUFFER, 74C367, 80C97
IC51 = 45xx:4543: BCD to 7-segment LCD DECODER
IC52 IC53 = memory:2114: MEMORY
IC57 = 40xx:4051: 8-channel ANALOG MULTIPLEXER
IC61 = 40xx:4035: 4-bit parallel in/out SHIFT REGISTER
LED1 = led-7-segment:S4301B: Single Digit Seven-Segment Display (cathode common) Source: LITEON .. S4301B.pdf; OC_FARNELL: unknown; OC_NEWARK: unknown
R1-R13 = rcl:R-US_: RESISTOR, American symbol
START UPBIRD = switch:55?: PUSHBUTTON SERIES 5500 SWITCHES Source: www.e-switch.com .. 5500.pdf